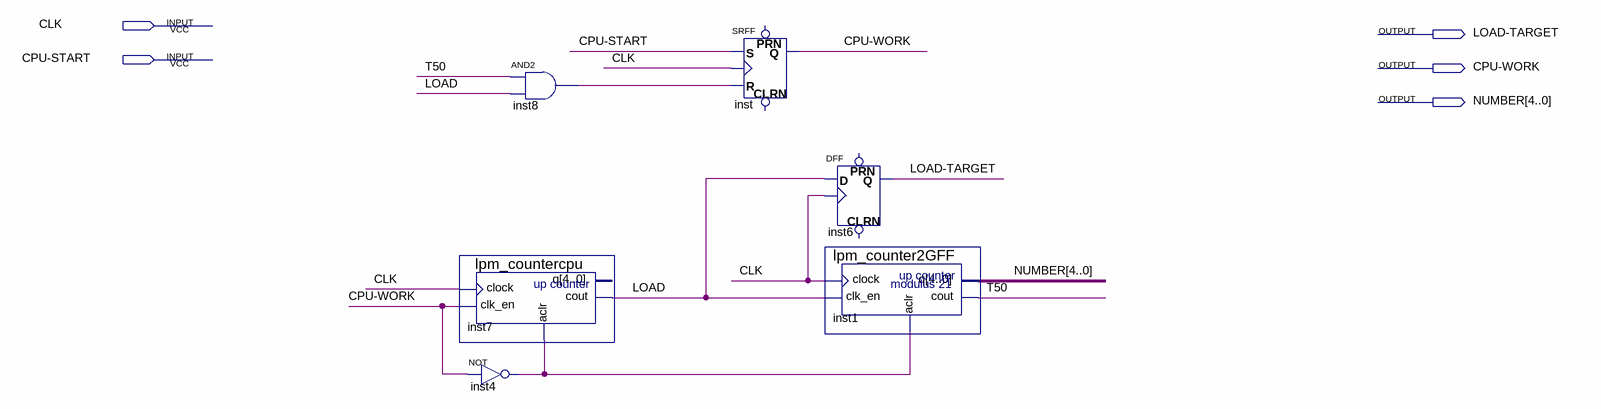
[diagram p0: schematic sheet]
// Quartus schematic HTPA_CPU_Controller.bdf as structural Verilog: 6 symbols, 5 pins
module HTPA_CPU_Controller (
  input  CLK,
  input  \CPU-START ,
  output \LOAD-TARGET ,
  output \CPU-WORK ,
  output [4:0] NUMBER
);

  wire inst4_out, inst8_out, LOAD, T50;

  and inst8 (inst8_out, T50, LOAD);
  lpm_countercpu inst7 (.clock(CLK), .clk_en(\CPU-WORK ), .aclr(inst4_out), .cout(LOAD));  // open: q
  not inst4 (inst4_out, \CPU-WORK );
  SRFF inst (.S(\CPU-START ), .R(inst8_out), .CLK(CLK), .Q(\CPU-WORK ));  // open: PRN, CLRN
  DFF inst6 (.CLK(CLK), .D(LOAD), .Q(\LOAD-TARGET ));  // open: CLRN, PRN
  lpm_counter2GFF inst1 (.clock(CLK), .clk_en(LOAD), .aclr(inst4_out), .cout(T50), .q(NUMBER));
endmodule
